# EAGLE design nuproRemote (EAGLE 6.4)
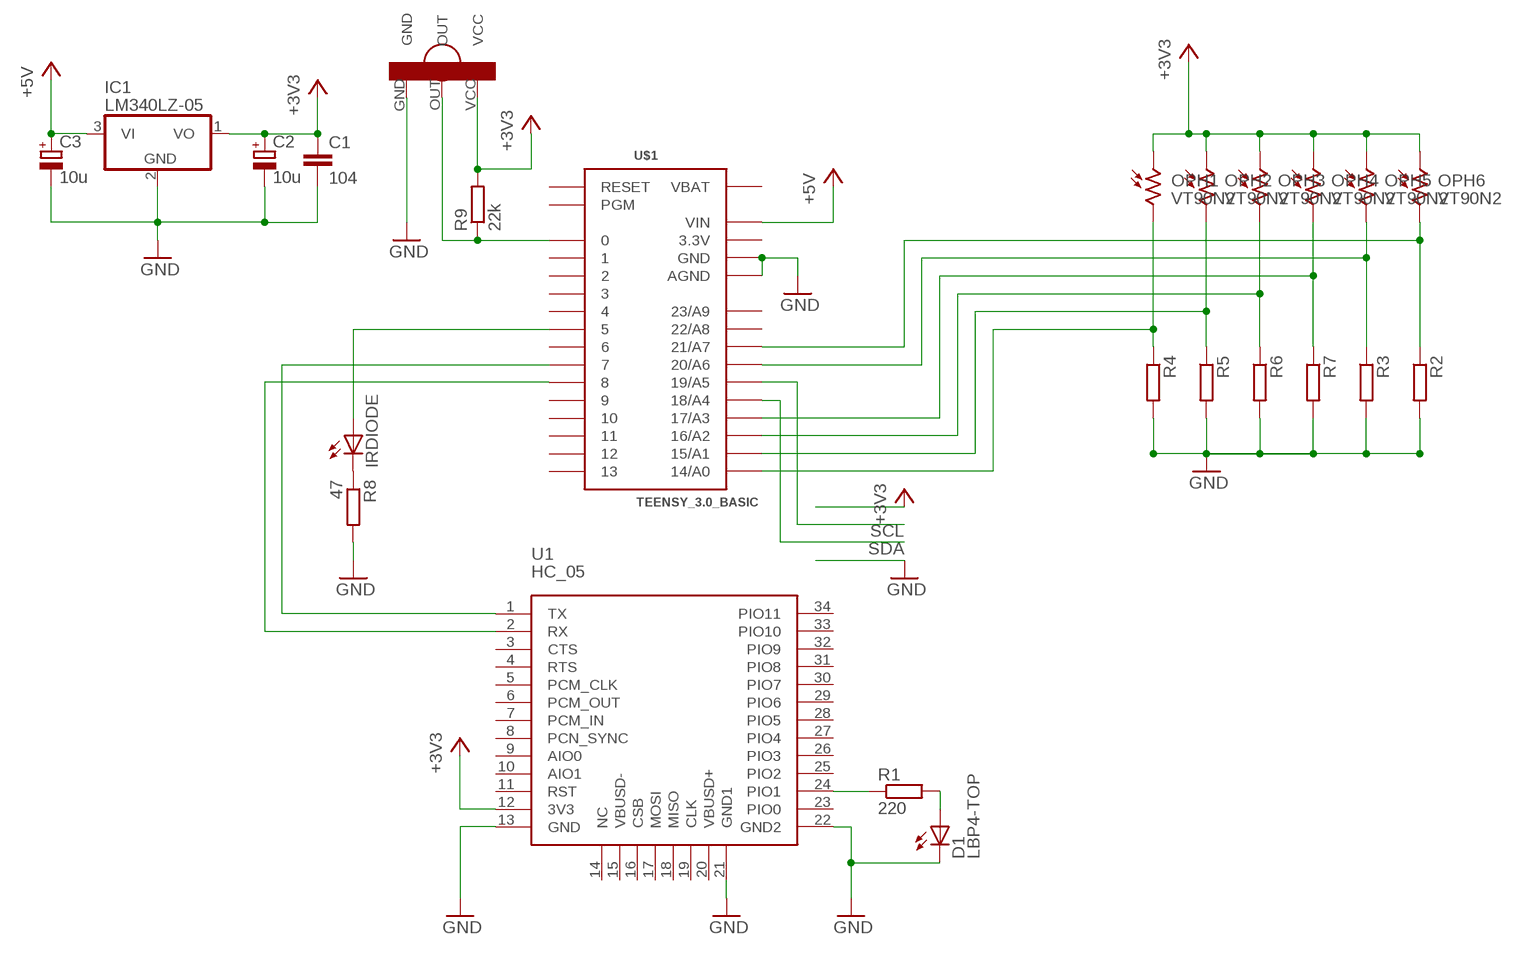
[diagram p0: schematic, sheet 1]

## Parts
C1  104  C-EUC1206  [C1206]
C2  10u  CPOL-EUC/6032-28R  [C/6032-28R]
C3  10u  CPOL-EUC/6032-28R  [C/6032-28R]
D1  LBP4-TOP  LED3MM  [LED3MM]
IC1  LM340LZ-05  [TO92]
IRDIODE  LEDCHIP-LED0805  [CHIP-LED0805]
OPH1  VT90N2  [VT900]
OPH2  VT90N2  [VT900]
OPH3  VT90N2  [VT900]
OPH4  VT90N2  [VT900]
OPH5  VT90N2  [VT900]
OPH6  VT90N2  [VT900]
R1  220  R-EU_0309/10  [0309/10]
R2  R-EU_0309/10  [0309/10]
R3  R-EU_0309/10  [0309/10]
R4  R-EU_0309/10  [0309/10]
R5  R-EU_0309/10  [0309/10]
R6  R-EU_0309/10  [0309/10]
R7  R-EU_0309/10  [0309/10]
R8  47  R-EU_0309/10  [0309/10]
R9  22k  R-EU_0309/10  [0309/10]
U1  HC_05  [BLUETOOTH_SMD]
U$1  TEENSY_3.0_BASIC  [TEENSY_3.0_BASIC]
U$2  OS-1838  [OS-1838]

## Nets
+3V3: C1.1 C2.+ IC1.1(VO) OPH1.1 OPH2.1 OPH3.1 OPH4.1 OPH5.1 OPH6.1 R9.2 U1.12(3V3) U$2.VCC
+5V: C3.+ IC1.3(VI) U$1.VIN
GND: C1.2 C2.- C3.- D1.K(C) IC1.2(GND) R2.2 R3.2 R4.2 R5.2 R6.2 R7.2 R8.2 U1.13(GND) U1.21(GND1) U1.22(GND2) U$1.AGND U$1.GND U$1.GND1(GND) U$2.GND
N$1: U1.2(RX) U$1.8
N$2: U1.1(TX) U$1.7
N$3: D1.A R1.2
N$4: IRDIODE.A U$1.5
N$5: R1.1 U1.24(PIO1)
N$6: OPH6.2 R2.1 U$1.21/A7
N$7: OPH5.2 R3.1 U$1.20/A6
N$8: IRDIODE.C R8.1
N$10: OPH1.2 R4.1 U$1.14/A0
N$11: OPH2.2 R5.1 U$1.15/A1
N$12: OPH3.2 R6.1 U$1.16/A2
N$13: OPH4.2 R7.1 U$1.17/A3
N$15: R9.1 U$1.0 U$2.OUT
SCL: U$1.19/A5
SDA: U$1.18/A4
Unconnected: U1.3(CTS) U1.4(RTS) U1.5(PCM_CLK) U1.6(PCM_OUT) U1.7(PCM_IN) U1.8(PCN_SYNC) U1.9(AIO0) U1.10(AIO1) U1.11(RST) U1.14(NC) U1.15(VBUSD-) U1.16(CSB) U1.17(MOSI) U1.18(MISO) U1.19(CLK) U1.20(VBUSD+) U1.23(PIO0) U1.25(PIO2) U1.26(PIO3) U1.27(PIO4) U1.28(PIO5) U1.29(PIO6) U1.30(PIO7) U1.31(PIO8) U1.32(PIO9) U1.33(PIO10) U1.34(PIO11) U$1.1 U$1.2 U$1.3 U$1.4 U$1.6 U$1.9 U$1.10 U$1.11 U$1.12 U$1.13 U$1.22/A8 U$1.23/A9 U$1.PGM U$1.RESET

## Power pins joined to a net without a drawn wire
3.3V: U$1.3.3V U$1.3.3V1(3.3V)
VBAT: U$1.VBAT

## Library data of the parts
C1 = rcl:C-EU: CAPACITOR, European symbol
C2 C3 = rcl:CPOL-EU: POLARIZED CAPACITOR, European symbol
D1 IRDIODE = led:LED: LED OSRAM: - CHIPLED LG R971, LG N971, LY N971, LG Q971, LY Q971, LO R971, LY R971 LH N974, LH R974 LS Q976, LO Q976, LY Q976 LO Q996 - Hyper CHIPLED LW Q18S LB Q993, LB Q99A, LB R99A - SideLED LS A670, LO A670, LY A670, LG A670, LP A670 LB A673, LV A673, LT A673, LW A673 LH A674 LY A675 LS A676, LA A676, LO A676, LY A676, LW A676 LS A679, LY A679, LG A679 - Hyper Micro SIDELED® LS Y876, LA Y876, LO Y876, LY Y876 LT Y87S - SmartLED LW L88C, LW L88S LB L89C, LB L89S, LG L890 LS L89K, LO L89K, LY L89K LS L896, LA L896, LO L896, LY L896 - TOPLED LS T670, LO T670, LY T670, LG T670, LP T670 LSG T670, LSP T670, LSY T670, LOP T670, LYG T670 LG T671, LOG T671, LSG T671 LB T673, LV T673, LT T673, LW T673 LH T674 LS T676, LA T676, LO T676, LY T676, LB T676, LH T676, LSB T676, LW T676 LB T67C, LV T67C, LT T67C, LS T67K, LO T67K, LY T67K, LW E67C LS E67B, LA E67B, LO E67B, LY E67B, LB E67C, LV E67C, LT E67C LW T67C LS T679, LY T679, LG T679 LS T770, LO T770, LY T770, LG T770, LP T770 LB T773, LV T773, LT T773, LW T773 LH T774 LS E675, LA E675, LY E675, LS T675 LS T776, LA T776, LO T776, LY T776, LB T776 LHGB T686 LT T68C, LB T68C - Hyper Mini TOPLED® LB M676 - Mini TOPLED Santana® LG M470 LS M47K, LO M47K, LY M47K Source: http://www.osram.convergy.de LUXEON: - LUMILED® LXK2-PW12-R00, LXK2-PW12-S00, LXK2-PW14-U00, LXK2-PW14-V00 LXK2-PM12-R00, LXK2-PM12-S00, LXK2-PM14-U00 LXK2-PE12-Q00, LXK2-PE12-R00, LXK2-PE12-S00, LXK2-PE14-T00, LXK2-PE14-U00 LXK2-PB12-K00, LXK2-PB12-L00, LXK2-PB12-M00, LXK2-PB14-N00, LXK2-PB14-P00, LXK2-PB14-Q00 LXK2-PR12-L00, LXK2-PR12-M00, LXK2-PR14-Q00, LXK2-PR14-R00 LXK2-PD12-Q00, LXK2-PD12-R00, LXK2-PD12-S00 LXK2-PH12-R00, LXK2-PH12-S00 LXK2-PL12-P00, LXK2-PL12-Q00, LXK2-PL12-R00 Source: www.luxeon.com KINGBRIGHT: KA-3528ASYC Source: www.kingbright.com
IC1 = linear:LM340?-*: Positive VOLTAGE REGULATOR Source: http://cache.national.com/ds/LM/LM340.pdf
OPH1-OPH6 = photo-elements:VT9: Photoconductive Cell VT900 Series Source: http://optoelectronics.perkinelmer.com/content/Datasheets/DTS_vt900seriesdatasheet.pdf
R1-R9 = resistor:R-EU_: RESISTOR, European symbol
U1 = SerialPortBluetooth:HC_05
U$1 = Teensy3.0:TEENSY_3.0_BASIC: Basic Teensy 3.0 with none of the 'inner' pins enabled. See '+4', 'AllAnalogPins", and 'AllPins' packages for additional pin holes, as needed.
U$2 = os1838:OS-1838

## Board
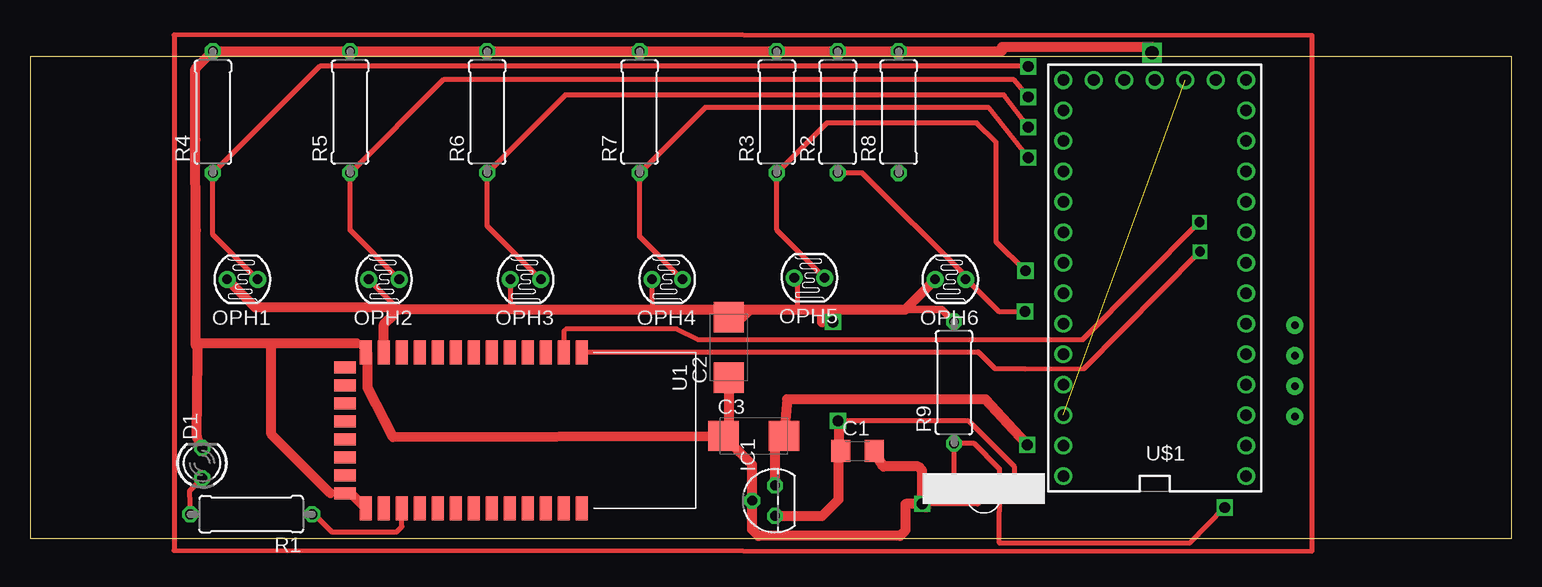
[diagram p1: board, top side]
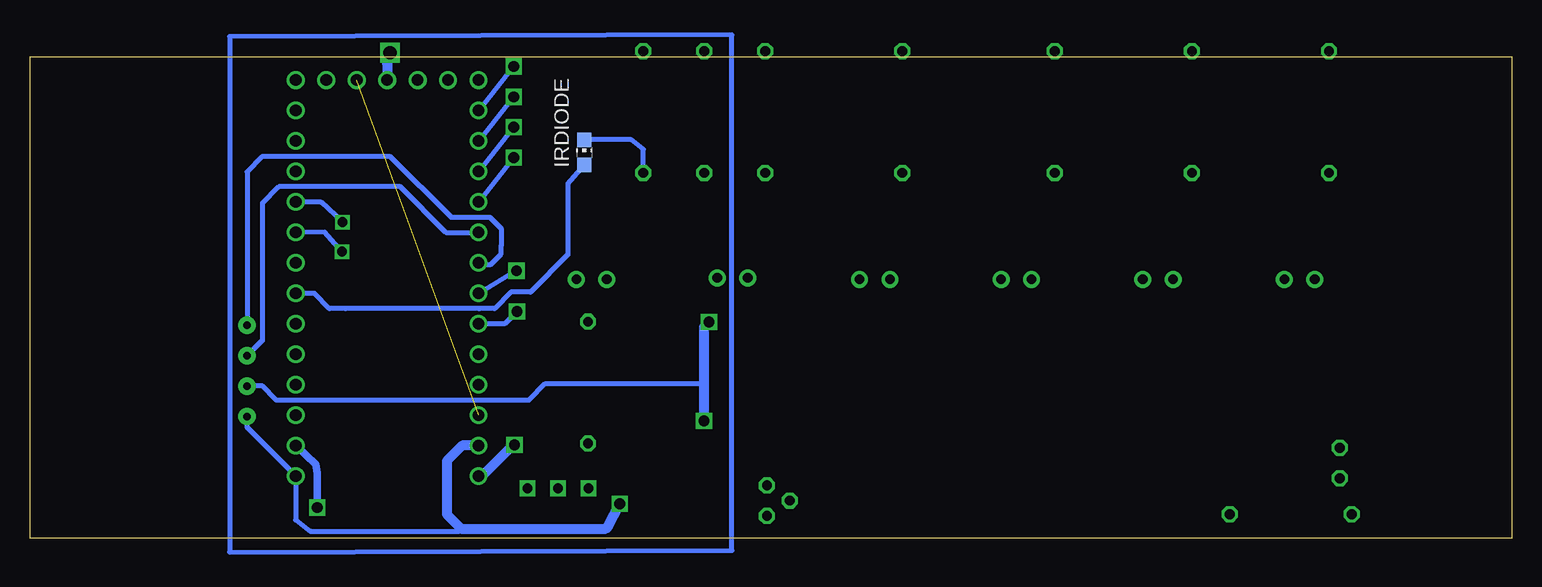
[diagram p2: board, bottom side, seen from below]

Size 123.5 x 40.17 mm. Coordinates in mm from the lower left corner, seen from the top.
Outline: 0,0 123.5,0 123.5,40.17 0,40.17 0,0
Copper layers (1*16): Top 0.035mm / dielectric 1.5mm / Bottom 0.035mm
Design rules "default": minimum track width 10mil, minimum drill 24mil, track to track 8mil, track to pad 8mil, pad to pad 8mil, via to via 8mil, smd to smd 8mil, copper to edge 40mil, drill to drill 8mil, minimum pad ring 10mil, minimum via ring 8mil, stop-mask expansion 4mil, vias tented up to drill 0mil, thermal gap 10mil

### Footprints (pad centres in the part's own frame; a part is rotated, then mirrored left to right if it is on the bottom)
C1206 = smd 1.6 x 1.8: 1 -1.4,0; 2 1.4,0
C/6032-28R = smd 2.55 x 2.5: + 2.525,0; - -2.525,0
LED3MM = drill 0.813 octagon: A -1.27,0; K 1.27,0
TO92 = drill 0.813 octagon: 1 -1.27,0; 2 0,1.905; 3 1.27,0
CHIP-LED0805 = smd 1.2 x 1.2: A 0,-1.05; C 0,1.05
VT900 = drill 0.8 pad 1.4: 1 -1.27,0; 2 1.27,0
0309/10 = drill 0.813 octagon: 1 -5.08,0; 2 5.08,0
BLUETOOTH_SMD = smd 2 x 1: 1 0,0; 2 0,-1.5; 3 0,-3; 4 0,-4.5; 5 0,-6; 6 0,-7.5; 7 0,-9; 8 0,-10.5; 9 0,-12; 10 0,-13.5; 11 0,-15; 12 0,-16.5; 13 0,-18; 22 13,-18; 23 13,-16.5; 24 13,-15; 25 13,-13.5; 26 13,-12; 27 13,-10.5; 28 13,-9; 29 13,-7.5; 30 13,-6; 31 13,-4.5; 32 13,-3; 33 13,-1.5; 34 13,0 | smd 1 x 1.8: 14 1.25,-19.75; 15 2.75,-19.75; 16 4.25,-19.75; 17 5.75,-19.75; 18 7.25,-19.75; 19 8.75,-19.75; 20 10.25,-19.75; 21 11.75,-19.75
TEENSY_3.0_BASIC = drill 0.965: 0 -7.62,13.97; 1 -7.62,11.43; 2 -7.62,8.89; 3 -7.62,6.35; 3.3V 7.62,11.43; 3.3V1 -2.54,-16.51; 4 -7.62,3.81; 5 -7.62,1.27; 6 -7.62,-1.27; 7 -7.62,-3.81; 8 -7.62,-6.35; 9 -7.62,-8.89; 10 -7.62,-11.43; 11 -7.62,-13.97; 12 -7.62,-16.51; 13 7.62,-16.51; 14/A0 7.62,-13.97; 15/A1 7.62,-11.43; 16/A2 7.62,-8.89; 17/A3 7.62,-6.35; 18/A4 7.62,-3.81; 19/A5 7.62,-1.27; 20/A6 7.62,1.27; 21/A7 7.62,3.81; 22/A8 7.62,6.35; 23/A9 7.62,8.89; AGND 7.62,13.97; GND -7.62,16.51; GND1 0,-16.51; PGM 2.54,-16.51; RESET 5.08,-16.51; VBAT -5.08,-16.51; VIN 7.62,16.51
OS-1838 = drill 0.8 square: GND 0,-1.27; OUT -2.54,-1.27; VCC 2.54,-1.27

### Placement (x,y rotation side)
C1  68.96,7.3 0 top
C2  58.24,15.92 90 top
C3  60.3,8.54 0 top
D1  14.35,6.29 90 top
IC1  62.09,3.15 90 top
IRDIODE  77.31,32.2 0 bottom
OPH1  17.7,21.6 0 top
OPH2  29.5,21.6 0 top
OPH3  41.3,21.6 0 top
OPH4  53.1,21.6 0 top
OPH5  64.95,21.73 0 top
OPH6  76.7,21.6 0 top
R1  18.43,2.02 180 top
R2  67.31,35.56 90 top
R3  62.23,35.56 90 top
R4  15.24,35.56 90 top
R5  26.67,35.56 90 top
R6  38.1,35.56 90 top
R7  50.8,35.56 90 top
R8  72.39,35.56 90 top
R9  77,13 90 top
U1  46,15.52 270 top
U$1  93.73,21.71 180 top
U$2  79.49,5.45 0 top

### Tracks (layer width: path | path; a pad name or v marks a point on that pad's centre or on a via)
3.3V  (1 unrouted)
+3V3  (via drill 0.6 pad 1.42, 0.9)
  Top 0.406: 67.38,7.26 C1.1 | 40.03,19.5 OPH3.1 40.03,19.52 40.46,19.09 | 30.74,19.09 30.53,19.3 | 30.53,19.3 OPH2.1 | OPH4.1 51.83,20.29 51.84,19.08 | 75.43,21.48 OPH6.1 | 67.42,9.7 v67.33,9.79 78.21,9.79 82,6 82,4.21 U$2.VCC | 49.32,19.09 49.36,19.08 | 64.1,19.09 63.93,19.09 63.93,21.48 OPH5.1 | 30.53,19.3 30.3,19.3 30.3,18.65
  Top 0.61: R9.2 75.99,19.09 72,19.09
  Top 0.813: OPH1.1 18.73,19.3 30.3,19.3 | 30.74,19.09 40.46,19.09 49.32,19.09 | 60,19.08 51.84,19.08 49.36,19.08 | 60,19.08 61.14,19.08 61.99,19.09 63.93,19.09 | 64.1,19.09 66,19.09 | 66,19.09 72,19.09 72.92,19.09 OPH6.1 | U1.12 29.5,17.85 30.3,18.65 | 67.42,9.7 67.38,9.7 67.38,7.26 67.38,3.24 66.02,1.88 IC1.1 | C2.+ 59.36,18.45 60,19.08 | v66.91,18.04 66,18.04 66,19.09
  Bottom 0.406: 67.33,12.99 67.41,12.91 80.55,12.91 81.91,11.55 102.96,11.55 103.02,11.61 104.11,12.7 v105.41,12.7
  Bottom 0.813: v66.91,18.04 67.33,17.62 67.33,12.99 v67.33,9.79
+5V  (via drill 0.9)
  Top 0.813: v83.11,7.79 81.98,9.01 79.61,11.6 63.09,11.6 C3.+ 62.09,7.8 IC1.3
  Bottom 0.406: v83.11,7.79 83.33,7.66
  Bottom 0.813: 83.33,7.66 85.8,5.21 U$1.VIN
GND  (via drill 0.6 pad 1.42, 0.9, 1.1 pad 0.61)
  Top 0.254: 13.97,15.24 13.97,16.51 13.83,16.51
  Top 0.406: 72.64,0.35 72.5,0.21 | 13.97,15.94 14.32,16.29 | 27.23,16.29 U1.13 28.11,15.41 | 19.9,16.27 19.93,16.29 | 26.75,3.77 U1.21 25.04,3.77 | 20.12,16 20.41,16.29 | U$2.GND 79.5,4.5 79.16,4.5 79.16,3.06 78.98,2.88 v74.35,2.88
  Top 0.813: 72.5,0.21 60.69,0.21 60.18,0.72 IC1.2 60.18,6.14 C3.- | D1.K 13.9,8.47 13.97,15.24 13.97,15.94 | 13.83,16.08 13.83,16.51 13.83,25.7 13.78,33.24 13.78,39.18 R4.2 R5.2 R6.2 R7.2 R3.2 R2.2 R8.2 81,40.64 81,41 93.5,41 v93.5,40.5 | 14.32,16.29 19.93,16.29 20.41,16.29 27.23,16.29 | 26.75,3.77 U1.22 | 25.04,3.77 20.12,8.69 20.12,16 | 28.11,15.41 28.11,12.59 30.24,8.46 C3.- | v74.35,2.88 74.67,2.56 | v74.35,2.88 74.35,5.65 74,6 71.11,6 C1.2 | v74.35,2.88 72.97,2.88 72.97,0.68 72.64,0.35 | C2.- 58.24,9.01 C3.-
  Bottom 0.406: 87.54,0.8 87.74,0.6 100.13,0.6 101.35,1.55 U$1.GND 105.41,9.27 v105.41,10.16
  Bottom 0.813: 75.41,0.87 75.35,0.98 | 75.35,0.98 v74.35,2.88 | v93.5,40.5 93.73,39.62 U$1.GND1 | U$1.AGND 87.47,7.75 88.75,6.46 88.75,2.02 87.54,0.8 75.53,0.8 75.35,0.98
N$1  (via drill 0.8)
  Top 0.406: 44.51,15.53 U1.2 44.5,17.28 44.69,17.47 53.87,17.47 55.65,16.57 79.2,16.57 80.25,16.57 87.75,16.57 v97.44,26.38
  Bottom 0.406: v97.44,26.38 99.24,28.04 U$1.8
N$2  (via drill 0.8)
  Top 0.406: v97.5,23.93 87.85,14.16 82.92,14.16 80.42,14.16 79.28,15.28 | 79.28,15.28 79.02,15.53 | 79.28,15.28 79,15.56 46.03,15.56 U1.1
  Bottom 0.406: v97.5,23.93 98.92,25.54 U$1.7
N$3
  Top 0.406: D1.A 13.29,3.94 R1.2
N$4
  Bottom 0.406: 101.35,20.36 U$1.5 99.77,20.45 98.55,19.17 97.22,19.16 86.06,19.16 86.02,19.16 84.78,19.16 83.42,20.55 81.78,20.55 78.67,23.66 78.67,29.57 IRDIODE.A
N$5
  Top 0.406: R1.1 23.68,2.02 25.16,0.53 30.55,0.53 31,0.98 U1.24
N$6  (via drill 0.9)
  Top 0.406: v82.91,18.93 80.72,18.93 78.01,21.64 OPH6.2 77.97,21.88 69.37,30.48 R2.1
  Bottom 0.406: v82.91,18.93 83.94,17.91 U$1.21/A7
N$7  (via drill 0.9)
  Top 0.406: OPH5.2 62.23,25.72 R3.1 66.41,34.66 78.91,34.66 80.48,33.09 80.48,24.74 v82.96,22.32
  Bottom 0.406: v82.96,22.32 U$1.20/A6
N$8
  Bottom 0.406: R8.1 72.39,32.46 73.38,33.26 IRDIODE.C
N$9
  Bottom 0.406: 65,-1 65,42 106.85,41.86 106.85,-1.14 65,-1
N$10  (via drill 0.9)
  Top 0.406: v83.19,39.37 24.13,39.37 R4.1 15.24,25.33 OPH1.2
  Bottom 0.406: v83.19,39.37 U$1.14/A0
N$11  (via drill 0.9)
  Top 0.406: OPH2.2 26.67,25.7 R5.1 34.44,38.25 82.01,38.25 v83.19,36.83
  Bottom 0.406: v83.19,36.83 U$1.15/A1
N$12  (via drill 0.9)
  Top 0.406: v83.19,34.29 81.17,36.98 44.6,36.98 R6.1 38.1,26.07 OPH3.2
  Bottom 0.406: v83.19,34.29 U$1.16/A2
N$13  (via drill 0.9)
  Top 0.406: v83.19,31.75 79.89,35.94 56.26,35.94 R7.1 50.8,25.17 OPH4.2
  Bottom 0.406: v83.19,31.75 U$1.17/A3
N$14
  Top 0.406: 12,42 12,-1 106.85,-1.07 106.85,41.93 12,42
N$15  (via drill 0.9)
  Top 0.406: U$2.OUT 77,4.17 | 77,4.17 77,4 | 77,4.17 R9.1 78.67,7.92 80.78,5.82 80.78,2.27 80.77,-0.37 96.68,-0.36 v99.56,2.58
  Bottom 0.61: v99.56,2.58 99.56,5.47 99.69,6.19 U$1.0
SCL  (via drill 0.6 pad 1.42)
  Bottom 0.406: v105.41,17.78 105.41,30.58 104.16,31.83 93.46,31.83 88.41,26.79 85.17,26.79 84.23,25.85 84.23,24.4 84.23,24.39 84.23,23.72 85.09,22.86 85.98,22.86 U$1.19/A5
SDA  (via drill 0.6 pad 1.42)
  Bottom 0.406: U$1.18/A4 88.83,25.52 92.64,29.33 102.76,29.33 104.14,27.95 104.14,16.51 v105.41,15.24